# Altium schematic sheet Regulators.SchDoc: Voltage Regulators
size 228 x 152 mm; DrawnBy: Kace Chandler; DocumentNumber: 12; SheetNumber: 12; SheetTotal: 23
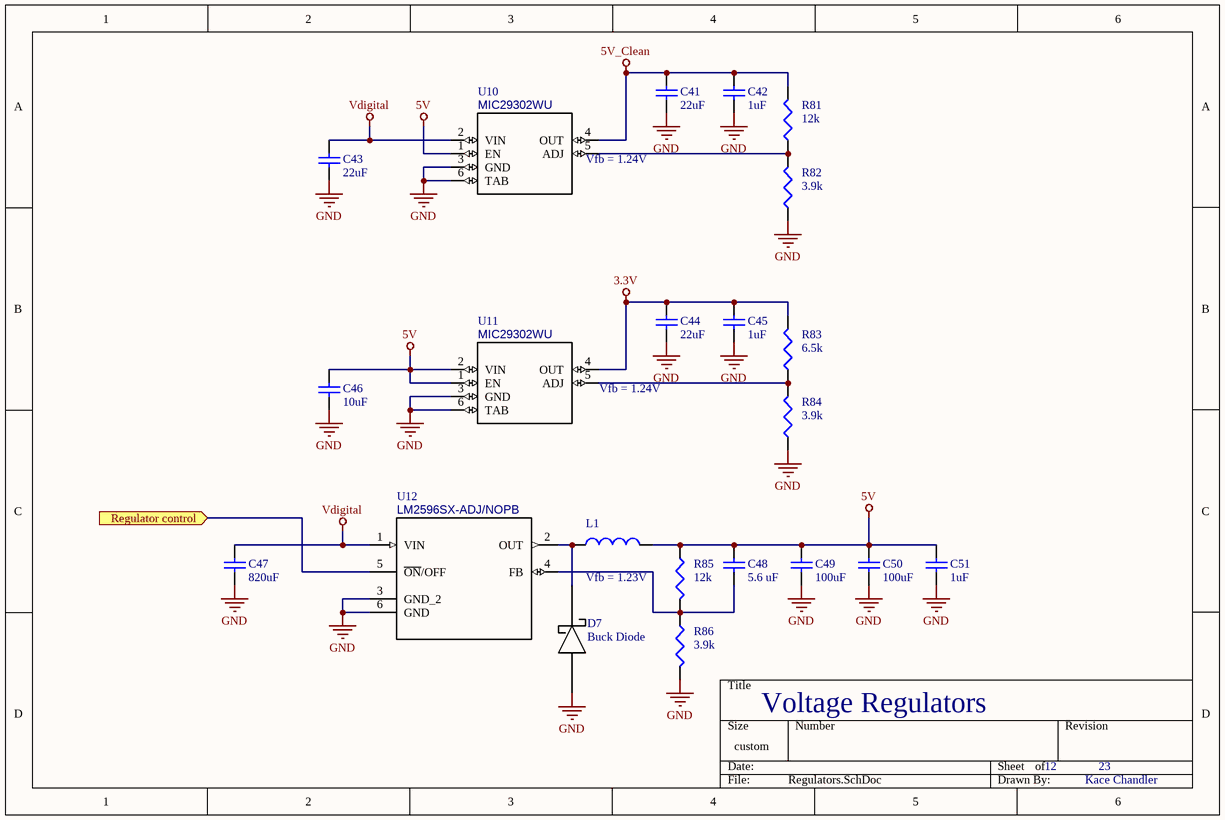
[diagram p0: Regulators.SchDoc]

## Parts
C41  value 22uF  [0603 to 1210 SMD]  (hidden comment: Cap)
C42  value 1uF  [0603 to 0805 SMD]  (hidden comment: Cap)
C43  value 22uF  [0603 to 1210 SMD]  (hidden comment: Cap)
C44  value 22uF  [0603 to 1210 SMD]  (hidden comment: Cap)
C45  value 1uF  [0603 to 0805 SMD]  (hidden comment: Cap)
C46  value 10uF  [0805 Footprint]  (hidden comment: Cap)
C47  value 820uF  [Electrolytic Cap]  (hidden comment: Cap)
C48  value 5.6 uF  [0603 to 1210 SMD]  (hidden comment: Cap)
C49  value 100uF  [0603 to 1210 SMD]  (hidden comment: Cap)
C50  value 100uF  [0603 to 1210 SMD]  (hidden comment: Cap)
C51  value 1uF  [0603 to 0805 SMD]  (hidden comment: Cap)
D7  Buck Diode  [*DO-214AC]
L1  7447709330  [INDUCTOR]  (value not drawn)
R81  value 12k  (hidden comment: Res3)
R82  value 3.9k  (hidden comment: Res3)
R83  value 6.5k  (hidden comment: Res3)
R84  value 3.9k  (hidden comment: Res3)
R85  value 12k  (hidden comment: Res3)
R86  value 3.9k  (hidden comment: Res3)
U10  MP: MIC29302WU  [*TO170P1435X465-6N]  (hidden comment: Linear Regulator)
U11  MP: MIC29302WU  [*TO170P1435X465-6N]  (hidden comment: Linear Regulator)
U12  LM2596SX-ADJ/NOPB  [*TO170P1435X465-6N]

## Ports
Regulator control (in)

## Nets
3.3V: C44.2 C45.2 R83.2 U11.4(OUT)
5V: C46.2 C48.2 C49.2 C50.2 C51.2 L1.2 R85.1 U10.1(EN) U11.1(EN) U11.2(VIN)
5V_Clean: C41.2 C42.2 R81.2 U10.4(OUT)
GND: C41.1 C42.1 C43.1 C44.1 C45.1 C46.1 C47.1 C49.1 C50.1 C51.1 D7.1(A) R82.1 R84.1 R86.2 U10.3(GND) U10.6(TAB) U11.3(GND) U11.6(TAB) U12.3(GND_2) U12.6(GND)
Vdigital: C43.2 C47.2 U10.2(VIN) U12.1(VIN)
Regulator control: U12.5(~{ON}/OFF) ; port Regulator control
NetC48_1: C48.1 R85.2 R86.1 U12.4(FB)
NetD7_2: D7.2(C) L1.1 U12.2(OUT)
NetR81_1: R81.1 R82.2 U10.5(ADJ)
NetR83_1: R83.1 R84.2 U11.5(ADJ)

## Notes on the sheet
- (near U10) Vfb = 1.24V
- (near U11) Vfb = 1.24V
- Vfb = 1.23V

## Library data of the parts
C41-C51 = Cap: Capacitor; Published: 8-Jun-2000; LatestRevisionDate: 17-Jul-2002; LatestRevisionNote: Re-released for DXP Platform.; PackageReference: RAD-0.3; Publisher: Altium Limited; PackageDescription: Radial Cap, Thru-Hole; 2 Leads; 0.3 in Pin Spacing
L1 = Buck Inductor: Inductor, SMD [WÃ¼rth Elektronik] 7447709330 Inductor, SMD; MF: Wurth Electronics; MP: 7447709330; Availability: Unavailable; SnapEDA_Link: https://www.snapeda.com/parts/7447709330/Wurth%20Electronics%20Inc./view-part/?ref=snap; Price: None; Package: 1210 WÃ¼rth Elektronik; Value: *; Supplier 1: Digi-Key; Supplier Part Number 1: 732-1244-6-ND
R81-R86 = Res3: Resistor; Published: 8-Jun-2000; LatestRevisionDate: 29-May-2009; LatestRevisionNote: IPC-7351 Footprint Added.; PackageReference: J1-0603; Publisher: Altium Limited; PackageDescription: Chip Resistor
U10 U11 = Linear Regulator: MIC29302 Series 3 A 1.24 to 26 V ADJ Output Voltage LDO Regulator - TO-263-5; MF: Microchip; Package: TO-263-5 Microchip; Availability: Unavailable; SnapEDA_Link: https://www.snapeda.com/parts/MIC29302WU/Microchip/view-part/?ref=snap; Price: None; Value: *; Supplier 1: Digi-Key; Supplier Part Number 1: 576-1125-1-ND
U12 = Switching Regulator ADJ: SIMPLE SWITCHERÂ® 4.5V to 40V, 3A Low Component Count Step-Down Regulator 5-DDPAK/TO-263 -40 to 125; MF: Texas Instruments; Package: TO-263-6 Texas Instruments; Availability: Unavailable; MP: LM2596SX-ADJ/NOPB; SnapEDA_Link: https://www.snapeda.com/parts/LM2596SX-ADJ/NOPB/Texas%20Instruments/view-part/?ref=snap; Price: None; Value: *; Supplier 1: Digi-Key; Supplier Part Number 1: 296-35399-1-ND
D7 = Buck Diode: Supplier 1: Digi-Key; Supplier Part Number 1: VSSC8L45-M3/9ATGICT-ND